# Altium schematic sheet 原理图.SchDoc
size A4
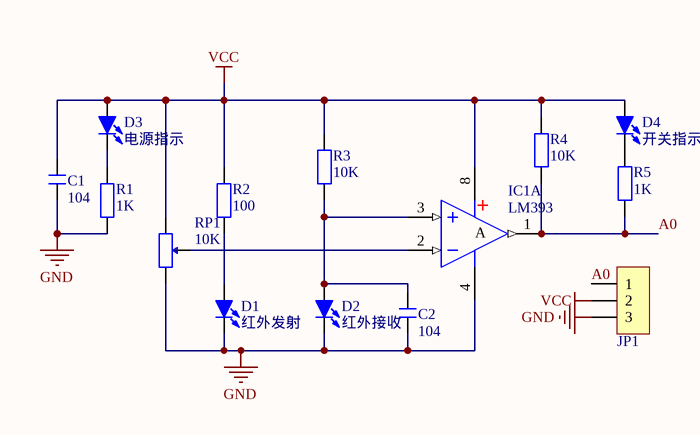
[diagram p0: 原理图.SchDoc]

## Parts
C1  104  [C 0805]
C2  104  [C 0805]
D1  红外发射  [LED 3MM-B]
D2  红外接收  [LED 3MM-B]
D3  电源指示  [LED 0805G]
D4  开关指示  [LED 0805G]
IC1  LM393  [SOP8_L]  (part A of 2)
JP1  HDR-1X3  [HDR-1X3]  (value not drawn)
R1  1K  [R 0805]
R2  100  [R 0805]
R3  10K  [R 0805]
R4  10K  [R 0805]
R5  1K  [R 0805]
RP1  10K  [3362P]

## Nets
GND: C1.1 C2.1 D1.2(K) D2.2(K) IC1.4(V-) JP1.3 R1.1 RP1.3
VCC: C1.2 D3.1(A) D4.1(A) IC1.8(V+) JP1.2 R2.2 R3.2 R4.2 RP1.1
A0: IC1.1(OUT) JP1.1 R4.1 R5.1
NetC2_2: C2.2 D2.1(A) IC1.3(IN+) R3.1
NetD1_1: D1.1(A) R2.1
NetD3_2: D3.2(K) R1.2
NetD4_2: D4.2(K) R5.2
NetIC1_2: IC1.2(IN-) RP1.2

## Notes on the sheet
- (in symbol LM393, part A) A

## Library data of the parts
C1 C2 = C: 无极性贴片电容; 版权归属: 源创客; BOM名称: 无极性贴片电容; 学习资源: www.ooocke.com
D1 D2 = LED-3MM: 插件LED; 版权归属: 源创客; BOM名称: 插件LED; 学习资源: www.ooocke.com
D3 D4 = LED-SMD: 贴片LED; 版权归属: 源创客; BOM名称: 贴片LED; 学习资源: www.ooocke.com
IC1 = LM393: 双路电压比较; 版权归属: 源创客; BOM名称: 双路电压比较; 学习资源: www.ooocke.com
JP1 = Header 3: 3P接插件; 版权归属: 源创客; BOM名称: 3P接插件; 学习资源: www.ooocke.com
R1-R5 = R: 贴片电阻; 版权归属: 源创客; BOM名称: 贴片电阻; 学习资源: www.ooocke.com
RP1 = RP-ID: 插件单联电位器; BOM名称: 插件电位器; 版权归属: 源创客; 学习资源: www.ooocke.com